# EAGLE design Digithermo (EAGLE 9.0.0)
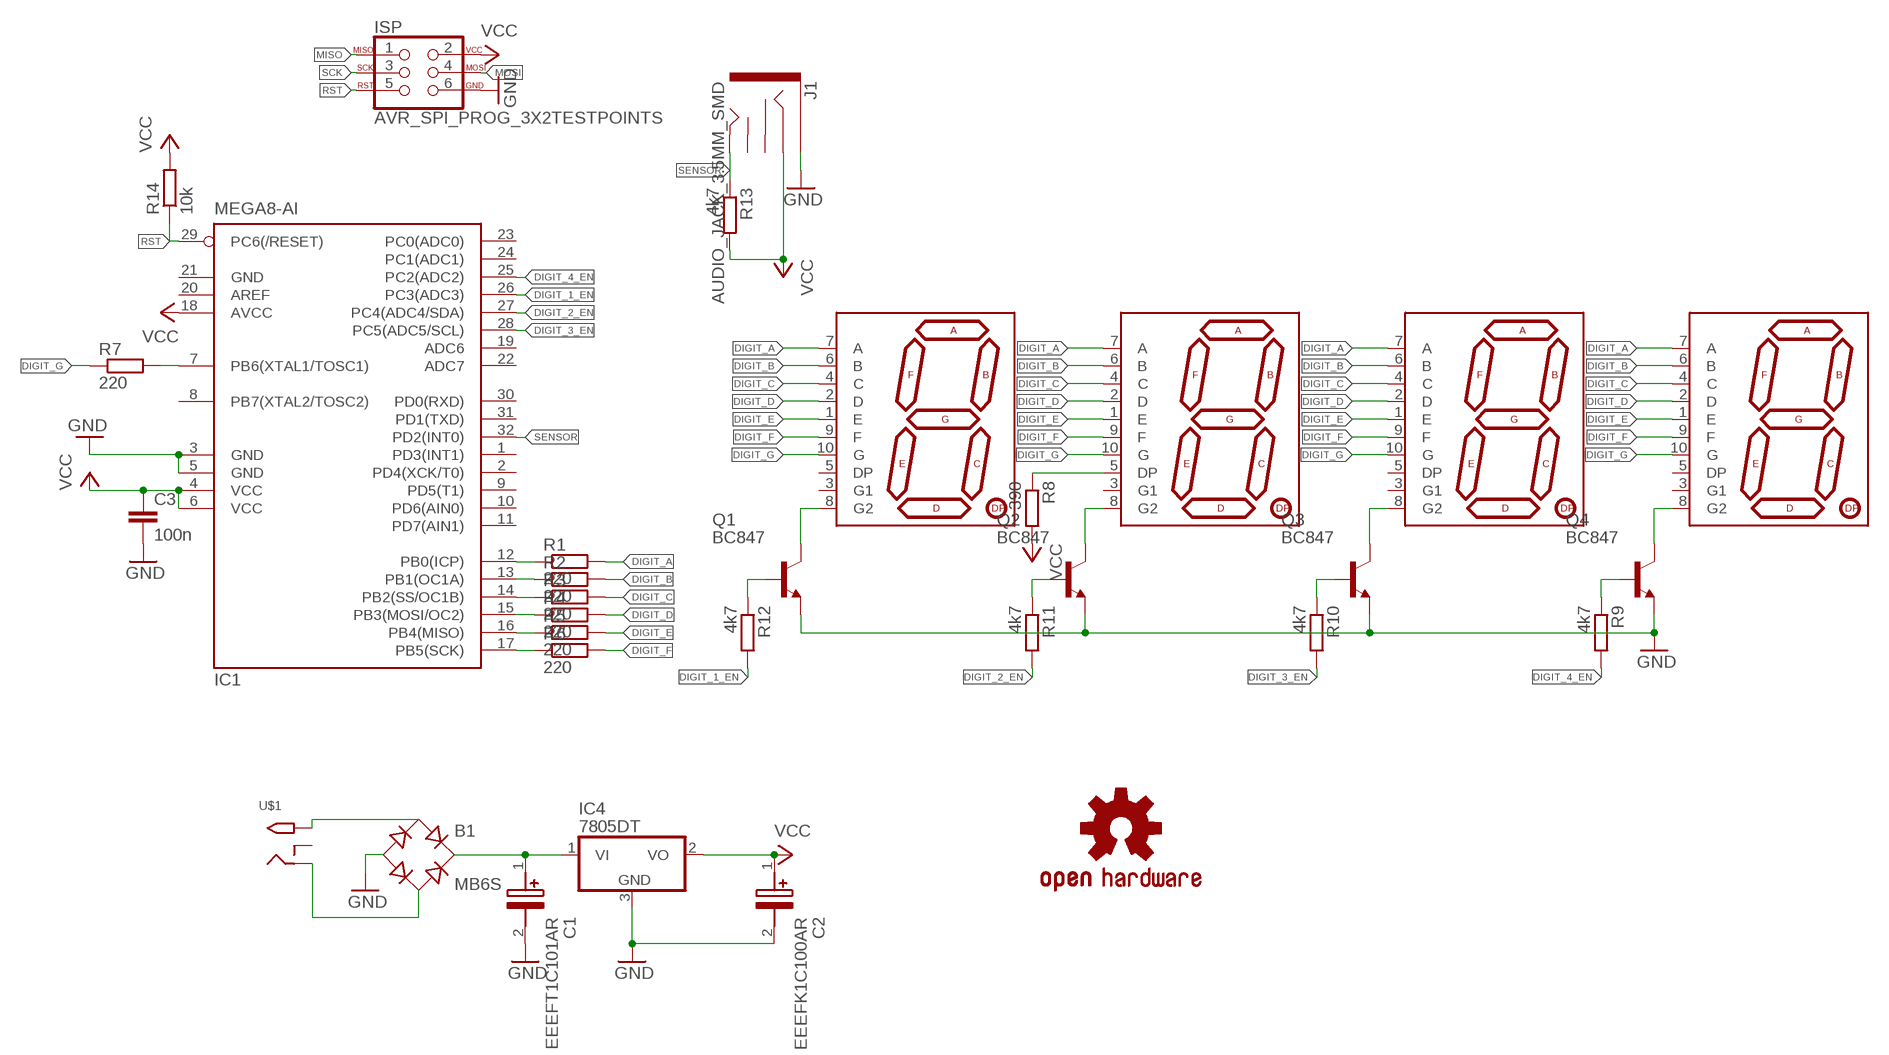
[diagram p0: schematic, sheet 1]

## Parts
B1  MB6S  [SOIC-4]
C1  EEEFT1C101AR  [HBV(C)]
C2  EEEFK1C100AR  [FKV(B)]
C3  100n  C-EUC0603  [C0603]
IC1  MEGA8-AI  [TQFP32-08]
IC4  7805DT  [TO252]
ISP  AVR_SPI_PROG_3X2TESTPOINTS  [2X3_TEST_POINTS]
J1  AUDIO_JACK_3.5MM_SMD  [AUDIO-JACK-3.5MM-SMD]
LOGO1  OSHW-LOGOL  [OSHW-LOGO-L]
Q1  BC847  [SOT23]
Q2  BC847  [SOT23]
Q3  BC847  [SOT23]
Q4  BC847  [SOT23]
R1  220  R-EU_R0603  [R0603]
R2  220  R-EU_R0603  [R0603]
R3  220  R-EU_R0603  [R0603]
R4  220  R-EU_R0603  [R0603]
R5  220  R-EU_R0603  [R0603]
R6  220  R-EU_R0603  [R0603]
R7  220  R-EU_R0603  [R0603]
R8  390  R-EU_R0603  [R0603]
R9  4k7  R-EU_R0603  [R0603]
R10  4k7  R-EU_R0603  [R0603]
R11  4k7  R-EU_R0603  [R0603]
R12  4k7  R-EU_R0603  [R0603]
R13  4k7  R-EU_R0603  [R0603]
R14  10k  R-EU_R0603  [R0603]
U1  7-SEGMENT-DISPLAYPTH  [7-SEGMENT-DISPLAY]
U2  7-SEGMENT-DISPLAYPTH  [7-SEGMENT-DISPLAY]
U3  7-SEGMENT-DISPLAYPTH  [7-SEGMENT-DISPLAY]
U4  7-SEGMENT-DISPLAYPTH  [7-SEGMENT-DISPLAY]
U$1  2.1MMJACKTHM  [PJ-102A]

## Nets
DIGIT_1_EN: IC1.26(PC3(ADC3)) R12.2
DIGIT_2_EN: IC1.27(PC4(ADC4/SDA)) R11.2
DIGIT_3_EN: IC1.28(PC5(ADC5/SCL)) R10.2
DIGIT_4_EN: IC1.25(PC2(ADC2)) R9.2
DIGIT_A: R1.2 U1.7(A) U2.7(A) U3.7(A) U4.7(A)
DIGIT_B: R2.2 U1.6(B) U2.6(B) U3.6(B) U4.6(B)
DIGIT_C: R3.2 U1.4(C) U2.4(C) U3.4(C) U4.4(C)
DIGIT_D: R4.2 U1.2(D) U2.2(D) U3.2(D) U4.2(D)
DIGIT_E: R5.2 U1.1(E) U2.1(E) U3.1(E) U4.1(E)
DIGIT_F: R6.2 U1.9(F) U2.9(F) U3.9(F) U4.9(F)
DIGIT_G: R7.1 U1.10(G) U2.10(G) U3.10(G) U4.10(G)
GND: B1.- C1.2(-) C2.2(-) C3.2 IC1.3(GND) IC1.5(GND) IC4.3(GND) ISP.6 J1.SLEEVE Q1.2(E) Q2.2(E) Q3.2(E) Q4.2(E)
MISO: IC1.16(PB4(MISO)) ISP.1 R5.1
MOSI: IC1.15(PB3(MOSI/OC2)) ISP.4 R4.1
N$1: B1.~1(AC1) U$1.TIP
N$2: B1.~2(AC2) U$1.RING
N$3: B1.+ C1.1(+) IC4.1(VI)
N$4: IC1.7(PB6(XTAL1/TOSC1)) R7.2
N$5: Q1.3(C) U1.8(G2)
N$7: R8.1 U2.5(DP)
N$11: IC1.14(PB2(SS/OC1B)) R3.1
N$12: IC1.13(PB1(OC1A)) R2.1
N$13: IC1.12(PB0(ICP)) R1.1
N$14: Q1.1(B) R12.1
N$15: Q2.3(C) U2.8(G2)
N$16: Q2.1(B) R11.1
N$17: Q3.3(C) U3.8(G2)
N$18: Q3.1(B) R10.1
N$19: Q4.3(C) U4.8(G2)
N$20: Q4.1(B) R9.1
RST: IC1.29(PC6(/RESET)) ISP.5 R14.1
SCK: IC1.17(PB5(SCK)) ISP.3 R6.1
SENSOR: IC1.32(PD2(INT0)) J1.TIP R13.1
VCC: C2.1(+) C3.1 IC1.4(VCC) IC1.6(VCC) IC1.18(AVCC) IC4.2(VO) ISP.2 J1.RING R8.2 R13.2 R14.2
Unconnected: IC1.1(PD3(INT1)) IC1.2(PD4(XCK/T0)) IC1.8(PB7(XTAL2/TOSC2)) IC1.9(PD5(T1)) IC1.10(PD6(AIN0)) IC1.11(PD7(AIN1)) IC1.19(ADC6) IC1.20(AREF) IC1.22(ADC7) IC1.23(PC0(ADC0)) IC1.24(PC1(ADC1)) IC1.30(PD0(RXD)) IC1.31(PD1(TXD)) J1.RSH J1.TSH U1.3(G1) U1.5(DP) U2.3(G1) U3.3(G1) U3.5(DP) U4.3(G1) U4.5(DP) U$1.RING_SW

## Power pins joined to a net without a drawn wire
GND: IC1.21(GND)

## Library data of the parts
B1 = rectifier:MB*S: Bridge Rectifier Source: http://www.fairchildsemi.com/ds/MB/MB6S.pdf
C1 = SamacSys_Parts:EEEFT1C101AR: Panasonic Aluminium Electrolytic Capacitor 100F 16V dc 5mm Surface Mount C FT SMD Series +105C Source: Datasheet <https://industrial.panasonic.com/cdbs/www-data/pdf/RDE0000/ABA0000C1240.pdf>; ALLIED_NUMBER: 70349111; ALLIED_PRICE/STOCK: https://www.alliedelec.com/panasonic-eeeft1c101ar/70349111/; ARROW_PART_NUMBER: EEEFT1C101AR; ARROW_PRICE/STOCK: https://www.arrow.com/en/products/eee-ft1c101ar/panasonic; DESCRIPTION: Panasonic Aluminium Electrolytic Capacitor 100F 16V dc 5mm Surface Mount C FT SMD Series +105C; HEIGHT: mm; MANUFACTURER_NAME: Panasonic; MANUFACTURER_PART_NUMBER: EEEFT1C101AR; RS_PART_NUMBER: 7472499P; RS_PRICE/STOCK: http://uk.rs-online.com/web/p/products/7472499P
C2 = SamacSys_Parts:EEEFK1C100AR: Panasonic 10F 20% 1.35 16 V dc SMD Cylindrical Aluminium Electrolytic Capacitor Source: Datasheet <https://industrial.panasonic.com/cdbs/www-data/pdf/RDE0000/ABA0000C1175.pdf>; ALLIED_NUMBER: 70256491; ALLIED_PRICE/STOCK: https://www.alliedelec.com/panasonic-eee-fk1c100ar/70256491/; ARROW_PART_NUMBER: EEEFK1C100AR; ARROW_PRICE/STOCK: http://uk.rs-online.com/web/p/products/0565572; DESCRIPTION: Panasonic 10F 20% 1.35 16 V dc SMD Cylindrical Aluminium Electrolytic Capacitor; HEIGHT: mm; MANUFACTURER_NAME: Panasonic; MANUFACTURER_PART_NUMBER: EEEFK1C100AR; RS_PART_NUMBER: 0565572; RS_PRICE/STOCK: http://uk.rs-online.com/web/p/products/0565572
C3 = resistor:C-EU: CAPACITOR, European symbol
IC1 = atmel:MEGA8: MICROCONTROLLER 8 Kbytes FLASH, 1 kbytes SRAM, 512 bytes EEPROM, USART, 6-channel 10 bit ADC, 2-channel 8 bit ADC Pin compatible with Atmega48, ATMega88, ATMega168 Source: avr.lbr; MPN: ATMEGA8-16AU; OC_FARNELL: 9171371; OC_NEWARK: 73M8863
IC4 = linear:78*: Positive VOLTAGE REGULATOR Source: http://cache.national.com/ds/LM/LM78L05.pdf http://www.fairchildsemi.com/ds/LM/LM7805.pdf
ISP = SparkFun-Connectors:AVR_SPI_PROG_3X2: AVR ISP 6 Pin This is the reduced ISP connector for AVR programming. Common on Arduino. This footprint will take up less PCB space and can be used with a 10-pin to 6-pin adapter such as SKU: BOB-08508 **Special note about "TEST_POINT" package. The stop mask is on the top side, so if you want your programming test points to be on the bottom of your board, make sure to place this package on the bottom side of the board. This also ensure that the orientation to program from the bottom side will be correct. SparkFun Products: SparkFun ISP Pogo Adapter <https://www.sparkfun.com/products/11591> - NS Tiny AVR Programmer <https://www.sparkfun.com/products/11801> -PTH
J1 = SparkFun-Connectors:AUDIO_JACK_3.5MM: Audio Jack 3.5mm variants of PTH and SMT stereo audio jack with bypass switches. SparkFun Products: SparkFun SparkPunk Sound Kit <[https://www.sparkfun.com/products/11177]> - PTH MP3 Trigger <https://www.sparkfun.com/products/13720> -3.5mm SMD SparkFun PicoBoard <https://www.sparkfun.com/products/11888>- 2.5mm SMD; PROD_ID: CONN-10353
LOGO1 = SparkFun-Aesthetics:OSHW-LOGO: Open-Source Hardware (OSHW) Logo This logo indicates the piece of hardware it is found on incorporates a OSHW license and/or adheres to the definition of open source hardware found here: http://freedomdefined.org/OSHW
Q1-Q4 = transistor:BC847: NPN TRANSISTOR
R1-R14 = resistor:R-EU_: RESISTOR, European symbol
U1-U4 = SparkFun-Retired:7-SEGMENT-DISPLAY
U$1 = adafruit:2.1MMJACK: 2.1mm x 5.5mm THM DC jack with internal switch. Digikey part #PJ-102A, 4UCON part #05537 2.1mm x 5.5mm SMT DC jack with internal switch. Digikey part #PJ-002A-SMT, 4UCON part #03267 By microbuilder.eu & adafruit.com

## Net classes
0 default: width 0.305 mm

## Board
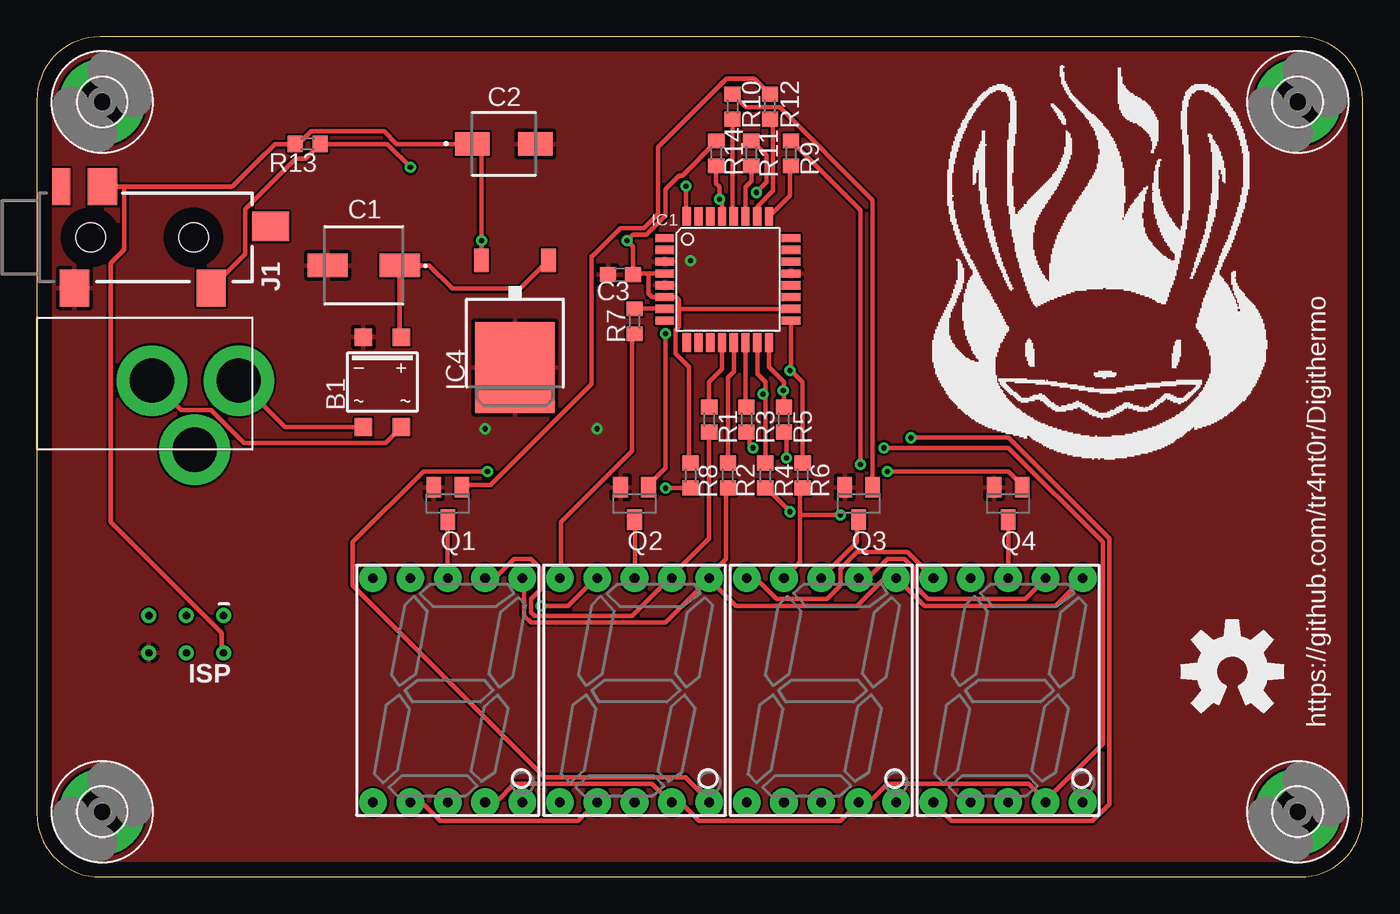
[diagram p1: board, top side]
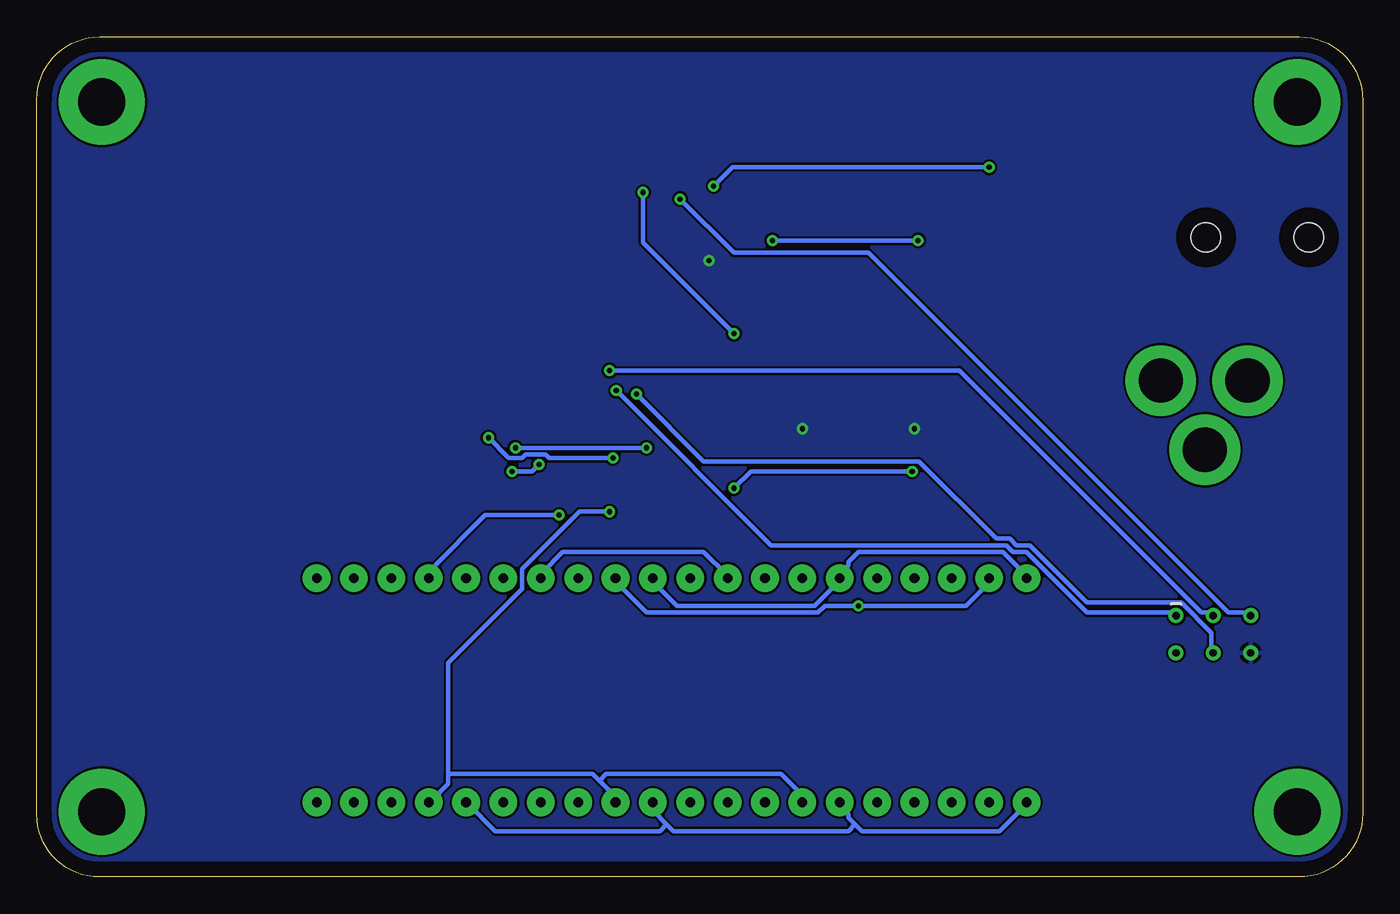
[diagram p2: board, bottom side, seen from below]

Size 90.15 x 57.14 mm. Coordinates in mm from the lower left corner, seen from the top.
Outline: 85.87,57.14 4.3,57.14 arc90 0,52.84 0,4.32 arc90 4.32,0 85.9,0 arc90 90.15,4.25 90.15,52.86 arc90 85.87,57.14
Copper layers (1*16): Top 0.035mm / dielectric 1.5mm / Bottom 0.035mm
Design rules "default": minimum track width 6mil, minimum drill 0.35mm, track to track 6mil, track to pad 6mil, pad to pad 6mil, via to via 6mil, smd to smd 6mil, copper to edge 40mil, drill to drill 6mil, minimum pad ring 10mil, minimum via ring 8mil, stop-mask expansion 4mil, vias tented up to drill 0mil, thermal gap 10mil

### Footprints (pad centres in the part's own frame; a part is rotated, then mirrored left to right if it is on the bottom)
SOIC-4 = smd 1.2 x 1.2: + 1.3,3.05; - -1.3,3.05; ~1 -1.3,-3.05; ~2 1.3,-3.05
HBV(C) = smd 2.75 x 1.6: 1 -2.45,0; 2 2.45,0
FKV(B) = smd 2.35 x 1.6: 1 -2.15,0; 2 2.15,0
C0603 = smd 1.1 x 1: 1 -0.85,0; 2 0.85,0
3,2-PAD = drill 3.2 pad 5.842: B3,2 0,0
TQFP32-08 = smd 1.27 x 0.559: 1 -4.293,2.8; 2 -4.293,2; 3 -4.293,1.2; 4 -4.293,0.4; 5 -4.293,-0.4; 6 -4.293,-1.2; 7 -4.293,-2; 8 -4.293,-2.8; 17 4.293,-2.8; 18 4.293,-2; 19 4.293,-1.2; 20 4.293,-0.4; 21 4.293,0.4; 22 4.293,1.2; 23 4.293,2; 24 4.293,2.8 | smd 0.559 x 1.27: 9 -2.8,-4.293; 10 -2,-4.293; 11 -1.2,-4.293; 12 -0.4,-4.293; 13 0.4,-4.293; 14 1.2,-4.293; 15 2,-4.293; 16 2.8,-4.293; 25 2.8,4.293; 26 2,4.293; 27 1.2,4.293; 28 0.4,4.293; 29 -0.4,4.293; 30 -1.2,4.293; 31 -2,4.293; 32 -2.8,4.293
TO252 = smd 1 x 1.6: 1 -2.28,-4.8; 2 2.28,-4.8 | smd 5.4 x 6.2: 3 0,2.5
2X3_TEST_POINTS = drill 0.508: 1 -2.54,-1.27; 2 -2.54,1.27; 3 0,-1.27; 4 0,1.27; 5 2.54,-1.27; 6 2.54,1.27
AUDIO-JACK-3.5MM-SMD = smd 2 x 2.5: RING 4.3,3.45; SLEEVE 2.4,-3.45; TIP 11.7,-3.45 | smd 1.2 x 2.5: RSH 1.5,3.45 | smd 2.5 x 2: TSH 15.75,0.75 | hole 2: 3.5,0; 10.5,0
SOT23 = smd 1 x 1.4: 1 -0.95,-1.1; 2 0.95,-1.1; 3 0,1.1
R0603 = smd 1 x 1.1: 1 -0.85,0; 2 0.85,0
7-SEGMENT-DISPLAY = drill 0.65 pad 1.88: 1 -5.08,-7.62; 2 -2.54,-7.62; 3 0,-7.62; 4 2.54,-7.62; 5 5.08,-7.62; 6 5.08,7.62; 7 2.54,7.62; 8 0,7.62; 9 -2.54,7.62; 10 -5.08,7.62
PJ-102A = drill 3 pad 4.8: RING 0.1,-3.39; RING_SW -4.6,-6.29; TIP 0.1,-9.29

### Placement (x,y rotation side)
B1  23.5,33.66 0 top
C1  22.23,41.59 180 top
C2  31.75,49.85 0 top
C3  39.69,40.96 180 top
E$1  [3,2-PAD]  4.45,52.7 0 top
E$2  [3,2-PAD]  85.72,52.7 0 top
E$3  [3,2-PAD]  85.72,4.45 0 top
E$4  [3,2-PAD]  4.45,4.45 0 top
IC1  46.99,40.64 0 top
IC4  32.51,37.15 180 top
ISP  10.16,16.51 180 top
J1  0.16,43.5 0 top
LOGO1  81.28,13.97 0 top
Q1  27.94,25.4 180 top
Q2  40.64,25.4 180 top
Q3  55.88,25.4 180 top
Q4  66.04,25.4 180 top
R1  45.72,31.11 270 top
R2  46.99,27.3 270 top
R3  48.26,31.11 270 top
R4  49.53,27.3 270 top
R5  50.8,31.11 270 top
R6  52.07,27.3 270 top
R7  40.64,37.78 90 top
R8  44.45,27.3 90 top
R9  51.28,49.21 270 top
R10  47.31,52.39 270 top
R11  48.58,49.21 270 top
R12  49.85,52.39 270 top
R13  18.41,49.85 180 top
R14  46.2,49.21 90 top
U1  27.94,12.7 0 top
U2  40.64,12.7 0 top
U3  53.34,12.7 0 top
U4  66.04,12.7 0 top
U$1  4.45,33.66 90 top

### Tracks (layer width: path | path; a pad name or v marks a point on that pad's centre or on a via)
DIGIT_1_EN
  Top 0.305: R12.2 50.06,51.36 50.06,46.99 50.06,46.67 48.99,45.6 IC1.26
DIGIT_2_EN
  Top 0.305: IC1.27 48.19,46.92 48.58,47.31 R11.2
DIGIT_3_EN
  Top 0.305: 47.39,51.45 R10.2 47.31,45.02 IC1.28
DIGIT_4_EN
  Top 0.305: R9.2 51.21,48.16 51.21,46.33 50.7,45.82 49.84,44.96 IC1.25
DIGIT_A
  Top 0.305: U3.7 56.01,20.5 56.69,20.5 57.84,21.64 58.98,21.64 59.66,20.95 59.66,19.81 60.58,18.9 67.21,18.9 68.58,20.27 U4.7 | R1.2 45.72,30.1 45.72,23.01 43.2,20.5 U2.7 42.98,20.27 40.46,17.75 33.83,17.75 33.6,17.98 33.6,18.9 34.29,19.58 34.29,20.95 33.6,21.64 32.46,21.64 31.32,20.5 30.63,20.5 U1.7
  Bottom 0.305: U3.7 55.78,20.5 55.78,20.73 54.41,22.1 44.81,22.1 43.2,20.5 U2.7
DIGIT_B
  Top 0.305: 46.86,26.44 R2.2 46.86,26.44 | 71.09,20.27 U4.6 71.09,20.27 | 71.09,20.27 69.27,18.44 60.35,18.44 58.52,20.27 U3.6 58.29,20.27 57.61,20.27 55.78,18.44 47.55,18.44 45.72,20.27 | 46.86,26.44 46.86,21.64 45.72,20.5 U2.6 | 45.72,20.27 42.75,17.3 33.6,17.3 33.15,17.75 33.15,20.27 U1.6 | 45.72,20.27 U2.6 | 45.72,20.27 U2.6
DIGIT_C  (via drill 0.35)
  Top 0.305: 48.46,30.1 R3.2 48.46,30.1 | U1.4 30.63,5.18 31.32,5.18 32.46,6.33 41.83,6.33 42.98,5.18 U2.4 43.2,4.95 43.89,4.95 45.03,3.81 54.63,3.81 55.78,4.95 U3.4 56.01,5.18 56.69,5.18 57.84,6.33 67.44,6.33 68.58,5.18 | 48.46,30.1 48.46,29.41 v48.69,29.18 | v57.61,29.18 66.06,29.18 72.47,22.78 72.47,9.07 68.58,5.18 | 68.58,5.18 U4.4 68.58,5.18
  Bottom 0.305: v57.61,29.18 v48.69,29.18
DIGIT_D  (via drill 0.35)
  Top 0.305: 49.61,26.44 R4.2 49.61,26.44 | U1.2 25.6,4.95 26.29,4.95 27.43,3.81 36.8,3.81 37.95,4.95 U2.2 | v51.21,24.84 49.61,26.44
  Bottom 0.305: v51.21,24.84 53.26,24.84 57.15,20.95 57.15,19.58 62.18,14.55 62.18,7.01 | 62.18,7.01 62.18,6.33 63.32,5.18 U4.2 | 51.89,6.55 52.35,7.01 62.18,7.01 | 51.89,6.55 50.98,5.64 50.98,5.18 U3.2 | 51.89,6.55 51.44,7.01 39.55,7.01 38.18,5.64 38.18,5.18 U2.2
DIGIT_E  (via drill 0.35)
  Top 0.305: 50.75,30.1 R5.2 50.98,30.1 v50.98,28.5 | v59.44,29.87 66.06,29.87 72.92,23.01 72.92,4.95 71.78,3.81 62.18,3.81 61.04,4.95 U4.1
  Bottom 0.305: 34.52,3.58 34.98,4.04 34.98,4.27 35.66,4.95 U2.1 | 34.52,3.58 34.06,3.12 24.69,3.12 22.86,4.95 U1.1 | 47.32,3.58 46.86,3.12 34.98,3.12 34.52,3.58 | 47.32,3.58 48.23,4.5 48.23,4.95 U3.1 | v50.98,28.5 55.32,28.5 55.55,28.73 56.92,28.73 57.15,28.5 58.06,28.5 v59.44,29.87 | 47.32,3.58 47.78,3.12 58.98,3.12 60.81,4.95 U4.1
DIGIT_F  (via drill 0.35)
  Top 0.305: 52.12,26.44 R6.2 51.89,26.44 51.89,24.61 | v34.29,18.44 36.12,18.44 37.95,20.27 U2.9 | 51.89,24.61 51.89,21.41 50.98,20.5 U3.9 | 51.89,24.61 v54.63,24.61
  Bottom 0.305: U1.9 25.6,20.27 25.6,19.81 26.98,18.44 v34.29,18.44 36.58,18.44 37.03,17.98 48.69,17.98 50.98,20.27 U3.9 | v54.63,24.61 59.66,24.61 63.32,20.95 63.32,20.5 U4.9
DIGIT_G
  Top 0.305: U3.10 48.46,20.27 48.92,20.27 50.29,18.9 53.72,18.9 54.63,19.81 54.63,20.95 55.78,22.1 59.21,22.1 60.81,20.5 U4.10 | R7.1 40.46,36.73 40.46,28.96 35.66,24.16 35.66,20.5 U2.10
  Bottom 0.305: U1.10 22.86,20.5 24.46,22.1 34.29,22.1 34.98,21.41 34.98,21.18 35.66,20.5 U2.10 35.43,20.27 37.26,18.44 46.63,18.44 47.78,19.58 47.78,19.81 48.23,20.27 U3.10
GND  (via drill 0.35)
  other vias: 44.45,41.91 30.48,30.48 38.1,30.48
  pour Top: 0,52.55 0,4.58 arc90 4.58,0 85.59,0 arc90 90.17,4.58 90.17,52.83 arc90 85.85,57.15 4.6,57.15 arc90
  pour Bottom: 0,52.55 0,4.58 arc90 4.58,0 85.59,0 arc90 90.17,4.58 90.17,52.81 arc90 85.83,57.15 4.6,57.15 arc90
MISO  (via drill 0.35)
  Top 0.305: IC1.16 49.79,34.66 50.8,33.66 50.8,33.07 | 50.8,33.07 R5.1 | v50.75,33.07 50.8,33.07
  Bottom 0.305: v50.75,33.07 40.23,22.55 24.23,22.55 23.77,22.1 22.86,22.1 18.75,17.98 12.8,17.98 ISP.1
MOSI  (via drill 0.35)
  Top 0.305: IC1.15 48.99,34.2 49.53,33.66 49.53,32.84 | 49.53,32.84 R4.1 | 49.53,32.84 49.61,32.84 49.53,32.84 | 49.53,32.84 v49.38,32.84
  Bottom 0.305: v49.38,32.84 44.81,28.27 30.18,28.27 24.92,23.01 24,23.01 23.55,22.55 22.63,22.55 18.75,18.67 12.34,18.67 10.29,16.61 10.29,15.24 ISP.4
N$1
  Top 0.305: U$1.TIP 16.89,30.61 B1.~1
N$2
  Top 0.305: B1.~2 23.72,29.53 14.09,29.53 11.86,31.76 9.83,31.76 U$1.RING
N$3
  Top 0.305: B1.+ 24.68,36.83 C1.1 26.67,41.59 28.26,40.01 32.85,40.01 IC4.1
N$4
  Top 0.305: R7.2 IC1.7
N$5
  Top 0.305: U1.8 Q1.3
N$7  (via drill 0.35)
  Top 0.305: v42.75,26.44 44.35,26.44 R8.1 | v30.63,27.58 26.29,27.58 21.49,22.78 21.49,19.81 34.52,6.78 44.12,6.78 45.72,5.18 U2.5
  Bottom 0.305: v42.75,26.44 41.6,27.58 v30.63,27.58
N$11
  Top 0.305: IC1.14 48.19,32.03 R3.1
N$12
  Top 0.305: IC1.13 47.39,34.37 46.99,33.97 R2.1
N$13
  Top 0.305: IC1.12 46.59,34.52 45.72,33.66 R1.1
N$14
  Top 0.305: R12.1 48.79,54.29 46.88,54.29 46.78,54.19 | 46.45,53.86 46.78,54.19 | 46.78,54.19 42.23,49.64 42.23,46.99 | 42.23,46.99 42.23,45.09 41.27,44.13 39.69,44.13 37.78,42.23 37.72,42.22 37.72,33.53 30.86,26.67 29.03,26.67 Q1.1 | 42.23,46.99 | 42.23,46.99
N$15
  Top 0.305: Q2.3 40.69,24.16 40.69,20.5 U2.8
N$16  (via drill 0.35)
  Top 0.305: v48.92,46.56 49.61,47.24 49.61,49.07 48.69,49.99 R11.1 | v42.75,36.96 42.75,27.81 41.6,26.67 Q2.1
  Bottom 0.305: v42.75,36.96 48.92,43.13 v48.92,46.56
N$17
  Top 0.305: Q3.3 55.78,24.16 55.78,22.78 53.49,20.5 U3.8
N$18
  Top 0.305: R10.1 48.2,52.34 50.52,52.34 56.83,46.04 Q3.1
N$19
  Top 0.305: Q4.3 66.06,24.16 66.06,20.5 U4.8
N$20  (via drill 0.35)
  Top 0.305: 66.98,26.67 Q4.1 66.98,26.67 | v57.84,27.58 66.06,27.58 66.98,26.67 | v56.01,28.04 56.01,45.33 R9.1
  Bottom 0.305: v56.01,28.04 56.46,27.58 v57.84,27.58
RST  (via drill 0.35)
  Top 0.305: R14.1 46.2,47.15 46.41,46.94 v46.41,46.1 46.59,45.92 IC1.29
  Bottom 0.305: v46.41,46.1 42.75,42.44 33.6,42.44 9.14,17.98 7.77,17.98 ISP.5
SCK  (via drill 0.35)
  Top 0.305: IC1.17 51.28,34.44 | 51.28,34.44 52.07,33.66 R6.1 | v51.21,34.44 51.28,34.44
  Bottom 0.305: v51.21,34.44 27.43,34.44 10.97,17.98 10.29,17.98 ISP.3
SENSOR  (via drill 0.35)
  Top 0.305: v44.13,46.99 44.13,44.99 IC1.32 | v25.4,48.26 23.81,49.85 19.37,49.85 R13.1 19.2,49.76 18.29,48.84 17.6,48.84 14.17,45.41 14.17,42.36 J1.TIP 11.89,40.16
  Bottom 0.305: v25.4,48.26 42.86,48.26 v44.13,46.99
VCC  (via drill 0.35)
  Top 0.305: 41.59,41.04 IC1.4 42.78,40.96 | 41.59,41.04 40.62,41.04 C3.1 40.54,42.67 40.54,42.88 v40.13,43.28 40.53,43.67 41.46,43.67 42.75,44.96 42.75,46.79 43.66,47.7 43.89,47.7 46.18,49.99 R14.2 | 41.59,41.04 41.59,39.69 41.84,39.44 IC1.6 43.47,39.44 43.66,39.24 43.66,38.63 | IC4.2 v30.23,43.28 30.23,49.22 C2.1 24.46,49.85 23.6,50.7 18.64,50.7 17.78,49.85 R13.2 16.19,49.85 15.06,48.72 15.05,48.72 13.28,46.95 5.94,46.95 | J1.RING 5.94,46.95 | 43.66,38.63 43.66,37.41 43.43,37.19 43.43,35.59 44.35,34.67 44.35,28.27 R8.2 | 5.94,46.95 5.94,42.67 5.03,41.76 5.03,24.16 12.57,16.61 12.57,15.24 ISP.2 | 43.66,38.63 51.21,38.63 IC1.18
  Bottom 0.305: v40.13,43.28 v30.23,43.28 29.97,43.28

### Text on the board
tPlace: https://github.com/tr4nt0r/Digithermo
200bmp: G:/Meine Ablage/EAGLE/404px-sam_and_max_sth.bmp | G:/Meine Ablage/EAGLE/404px-sam_and_max_sth.bmp | G:/Meine Ablage/EAGLE/404px-sam_and_max_sth.bmp